# Altium schematic sheet Data.SchDoc
size A3; SheetNumber: 3; SheetTotal: 3
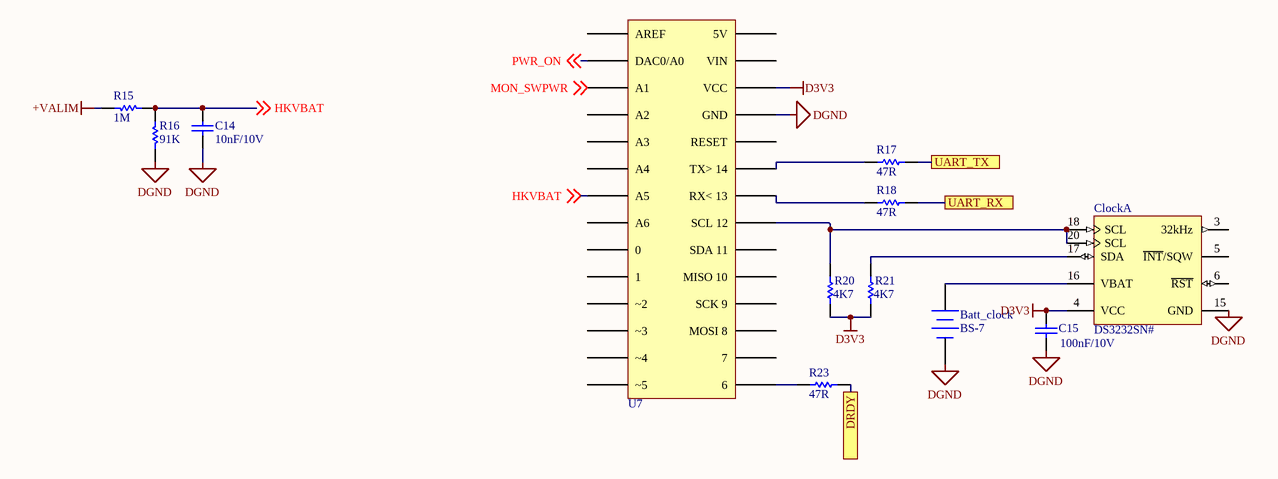
[diagram p0: Data.SchDoc]

## Parts
Batt_clock  BS-7  [BS-7-ND]
C14  value 10nF/10V  [0603]  (hidden comment: C0603)
C15  value 100nF/10V  [0805]  (hidden comment: C0805)
Clock  DS3232SN#  [W20#H2_N]  (part A of 2)
R15  value 1M  [0603]  (hidden comment: Res CMS)
R16  value 91K  [0603]  (hidden comment: Res CMS)
R17  value 47R  [0603]  (hidden comment: Res CMS)
R18  value 47R  [0603]  (hidden comment: Res CMS)
R20  value 4K7  [0603]  (hidden comment: Res CMS)
R21  value 4K7  [0603]  (hidden comment: Res CMS)
R23  value 47R  [0603]  (hidden comment: Res CMS)
U7  Arduino MKRZero  [Arduino MKRZero]  (value not drawn)

## Ports
DRDY, UART_RX, UART_TX

## Nets
+VALIM: R15.2
D3V3: C15.1 Clock.4(VCC) R20.1 R21.1 U7.26(VCC)
DGND: Batt_clock.2(-) C14.1 C15.2 Clock.15(GND) R16.2 U7.25(GND)
DRDY: R23.1 ; port DRDY
HKVBAT: C14.2 R15.1 R16.1 U7.7(A5) ; off-sheet HKVBAT
MON_SWPWR: U7.3(A1) ; off-sheet MON_SWPWR
PWR_ON: U7.2(DAC0/A0) ; off-sheet PWR_ON
UART_RX: R18.1 ; port UART_RX
UART_TX: R17.1 ; port UART_TX
NetBatt_clock_1: Batt_clock.1(+) Clock.16(VBAT)
NetClock_17: Clock.17(SDA) R21.2
NetClock_18: Clock.18(SCL) Clock.20(SCL) R20.2 U7.21(SCL_12)
NetR17_2: R17.2 U7.23(TX>_14)
NetR18_2: R18.2 U7.22(RX<_13)
NetR23_2: R23.2 U7.15(6)

Not connected (* = marked no-connect by the designer): Clock 3(32kHz) 5(~{INT}/SQW) 6(~{RST}); U7 1(AREF) 4(A2) 5(A3) 6(A4) 8(A6) 9(0) 10(1) 11(~2) 12(~3) 13(~4) 14(~5) 16(7) 17(MOSI_8) 18(SCK_9) 19(MISO_10) 20(SDA_11) 24(RESET) 27(VIN) 28(5V)

## Library data of the parts
Batt_clock = BS-7: BS-7 CR2032 battery holder; Published: 24-Mar-1999; LatestRevisionDate: 17-Jul-2002; LatestRevisionNote: Re-released for DXP Platform.; PackageReference: BAT-2; Publisher: Altium Limited; PackageDescription: Battery; 2 Leads
C14 = C0603: Ceramic Chip Capacitor - Standard; Note: Footprint corresponds to dimensions for bulk cassette packaging. This case size has tightened tolerances.; Published: 17-Jul-2002; LatestRevisionDate: 19-Mar-2004; LatestRevisionNote: Silkscreen size reduced.; DatasheetDocument: Mar-2001; PackageDocument: Mar-2001; PackageReference: 0603; Publisher: Altium Limited; Code_JEITA: 0603; Code_IPC: 1608 [0603]; ComponentLink1Description: Manufacturer Link; ComponentLink1URL: http://www.kemet.com/; ComponentLink2Description: Datasheet; ComponentLink2URL: http://www.kemet.com/kemet/web/homepage/kechome.nsf/vapubfilesname/F3102TA.pdf/$file/F3102TA.pdf
C15 = C0805: Ceramic Chip Capacitor - Standard; Note: Footprint corresponds to dimensions for bulk cassette packaging. This case size has tightened tolerances.; Published: 17-Jul-2002; LatestRevisionDate: 19-Mar-2004; LatestRevisionNote: Silkscreen size reduced.; DatasheetDocument: Mar-2001; PackageDocument: Mar-2001; PackageReference: 0805; Publisher: Altium Limited; Code_JEITA: 0805; Code_IPC: 2012[0805]; ComponentLink1Description: Manufacturer Link; ComponentLink1URL: http://www.kemet.com/; ComponentLink2Description: Datasheet; ComponentLink2URL: http://www.kemet.com/kemet/web/homepage/kechome.nsf/vapubfilesname/F3102TA.pdf/$file/F3102TA.pdf
Clock = CMP-0254-00381-1: Extremely Accurate I2C-Integrated Real-Time Clock/TCXO/Crystal and SRAM, 20-Pin SO, -40 to 85 degC, RoHS Qualified; PackageDescription: 20-Pin Small-Outline IC, Wide (0.3in), 1.27 mm Pitch, SOIC (W), RoHS Qualified; Code_JEDEC: MS-013-AC; ComponentLink2URL: http://datasheets.maxim-ic.com/en/ds/DS3232.pdf; ComponentLink1URL: http://www.maxim-ic.com; PackageVersion: revD, 2010; Code_IPC: SOIC127P1030-20; ComponentLink3URL: http://pdfserv.maxim-ic.com/package_dwgs/21-0042.PDF; ComponentLink1Description: Manufacturer URL; PackageReference: W20#H2; ComponentLink2Description: Datasheet; ComponentLink3Description: Package Specification; DatasheetVersion: Rev 5, Jul-2010
R15-R18 R20 R21 R23 = Res CMS: Resistor; Published: 8-Jun-2000; LatestRevisionDate: 17-Jul-2002; LatestRevisionNote: Re-released for DXP Platform.; PackageReference: AXIAL-0.3; Publisher: Altium Limited; PackageDescription: Axial Device, Thru-Hole; 2 Leads; 0.3 in Pin Spacing